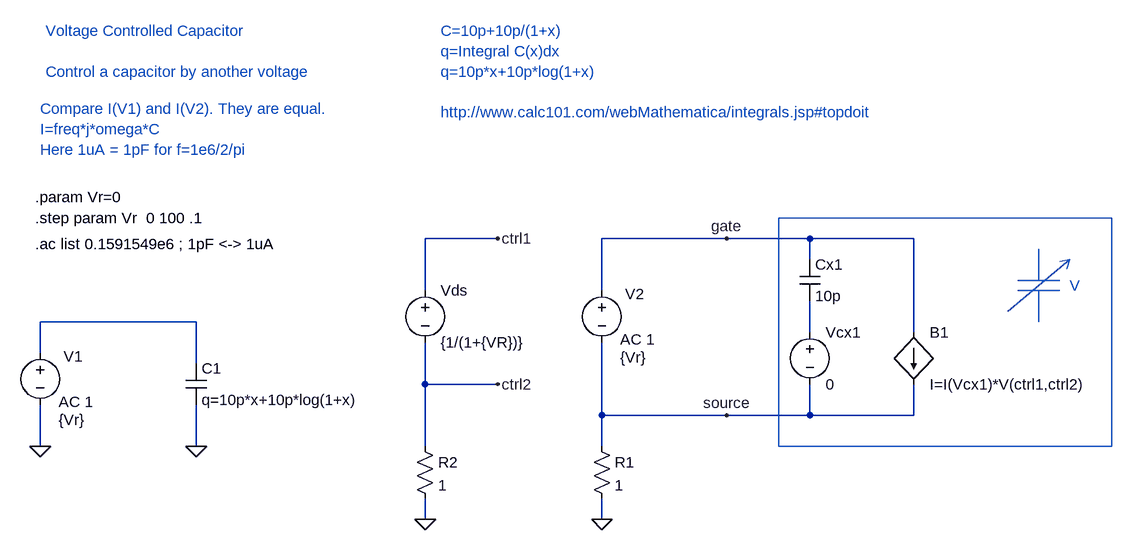
[diagram p0: schematic voltage_controlled_cap1.asc]
voltage_controlled_cap1.asc, the LTspice schematic file:
Version 4
SHEET 1 880 868
WIRE -448 176 -560 176
WIRE -96 176 -288 176
WIRE 32 176 -96 176
WIRE 192 176 32 176
WIRE 32 208 32 176
WIRE -560 256 -560 176
WIRE -288 256 -288 176
WIRE -912 304 -1152 304
WIRE 32 320 32 272
WIRE 192 320 192 176
WIRE -1152 352 -1152 304
WIRE -912 368 -912 304
WIRE -560 400 -560 336
WIRE -448 400 -560 400
WIRE -288 448 -288 336
WIRE -96 448 -288 448
WIRE 32 448 32 400
WIRE 32 448 -96 448
WIRE 192 448 192 400
WIRE 192 448 32 448
WIRE -1152 496 -1152 432
WIRE -912 496 -912 432
WIRE -560 496 -560 400
WIRE -288 496 -288 448
WIRE -560 608 -560 576
WIRE -288 608 -288 576
FLAG -912 496 0
FLAG -1152 496 0
FLAG -288 608 0
FLAG -96 176 gate
FLAG -96 448 source
FLAG -560 608 0
FLAG -448 176 ctrl1
FLAG -448 400 ctrl2
SYMBOL voltage -1152 336 R0
WINDOW 0 36 21 Left 0
WINDOW 3 28 119 Left 0
WINDOW 123 28 91 Left 0
WINDOW 39 0 0 Left 0
SYMATTR InstName V1
SYMATTR Value {Vr}
SYMATTR Value2 AC 1
SYMBOL cap -928 368 R0
SYMATTR InstName C1
SYMATTR Value q=10p*x+10p*log(1+x)
SYMBOL voltage -288 240 R0
WINDOW 0 36 21 Left 0
WINDOW 3 28 119 Left 0
WINDOW 123 28 91 Left 0
WINDOW 39 0 0 Left 0
SYMATTR InstName V2
SYMATTR Value {Vr}
SYMATTR Value2 AC 1
SYMBOL cap 16 208 R0
SYMATTR InstName Cx1
SYMATTR Value 10p
SYMBOL voltage 32 304 R0
SYMATTR InstName Vcx1
SYMATTR Value 0
SYMBOL bi 192 320 R0
SYMATTR InstName B1
SYMATTR Value I=I(Vcx1)*V(ctrl1,ctrl2)
SYMBOL res -304 480 R0
SYMATTR InstName R1
SYMATTR Value 1
SYMBOL voltage -560 240 R0
SYMATTR InstName Vds
SYMATTR Value {1/(1+{VR})}
SYMBOL res -576 480 R0
SYMATTR InstName R2
SYMATTR Value 1
TEXT -1160 144 Left 0 !.step param Vr  0 100 .1
TEXT -1160 184 Left 0 !.ac list 0.1591549e6 ; 1pF <-> 1uA
TEXT -536 -144 Left 0 ;C=10p+10p/(1+x)\nq=Integral C(x)dx\nq=10p*x+10p*log(1+x)\n \nhttp://www.calc101.com/webMathematica/integrals.jsp#topdoit
TEXT -1152 -24 Left 0 ;Compare I(V1) and I(V2). They are equal.\nI=freq*j*omega*C\nHere 1uA = 1pF for f=1e6/2/pi
TEXT -1160 112 Left 0 !.param Vr=0
TEXT -1144 -144 Left 0 ;Voltage Controlled Capacitor\n \nControl a capacitor by another voltage
TEXT 432 248 Left 0 ;V
LINE Normal 416 240 352 240
LINE Normal 416 256 352 256
LINE Normal 384 192 384 240
LINE Normal 384 304 384 256
LINE Normal 432 208 336 288
LINE Normal 427 223 432 208
LINE Normal 416 211 432 208
RECTANGLE Normal 496 496 -16 144

The netlist it stands for:
* voltage_controlled_cap1.asc
V1 N001 0 {Vr} AC 1
C1 N001 0 q=10p*x+10p*log(1+x)
V2 gate source {Vr} AC 1
Cx1 gate N002 10p
Vcx1 N002 source 0
B1 gate source I=I(Vcx1)*V(ctrl1,ctrl2)
R1 source 0 1
Vds ctrl1 ctrl2 {1/(1+{VR})}
R2 ctrl2 0 1
.step param Vr  0 100 .1
.ac list 0.1591549e6 ; 1pF <-> 1uA
* C=10p+10p/(1+x)
* q=Integral C(x)dx
* q=10p*x+10p*log(1+x)
* http://www.calc101.com/webMathematica/integrals.jsp#topdoit
* Compare I(V1) and I(V2). They are equal.
* I=freq*j*omega*C
* Here 1uA = 1pF for f=1e6/2/pi
.param Vr=0
* Voltage Controlled Capacitor
* Control a capacitor by another voltage
* V
.backanno
.end